# EAGLE design solenoid (EAGLE 8.2.1)
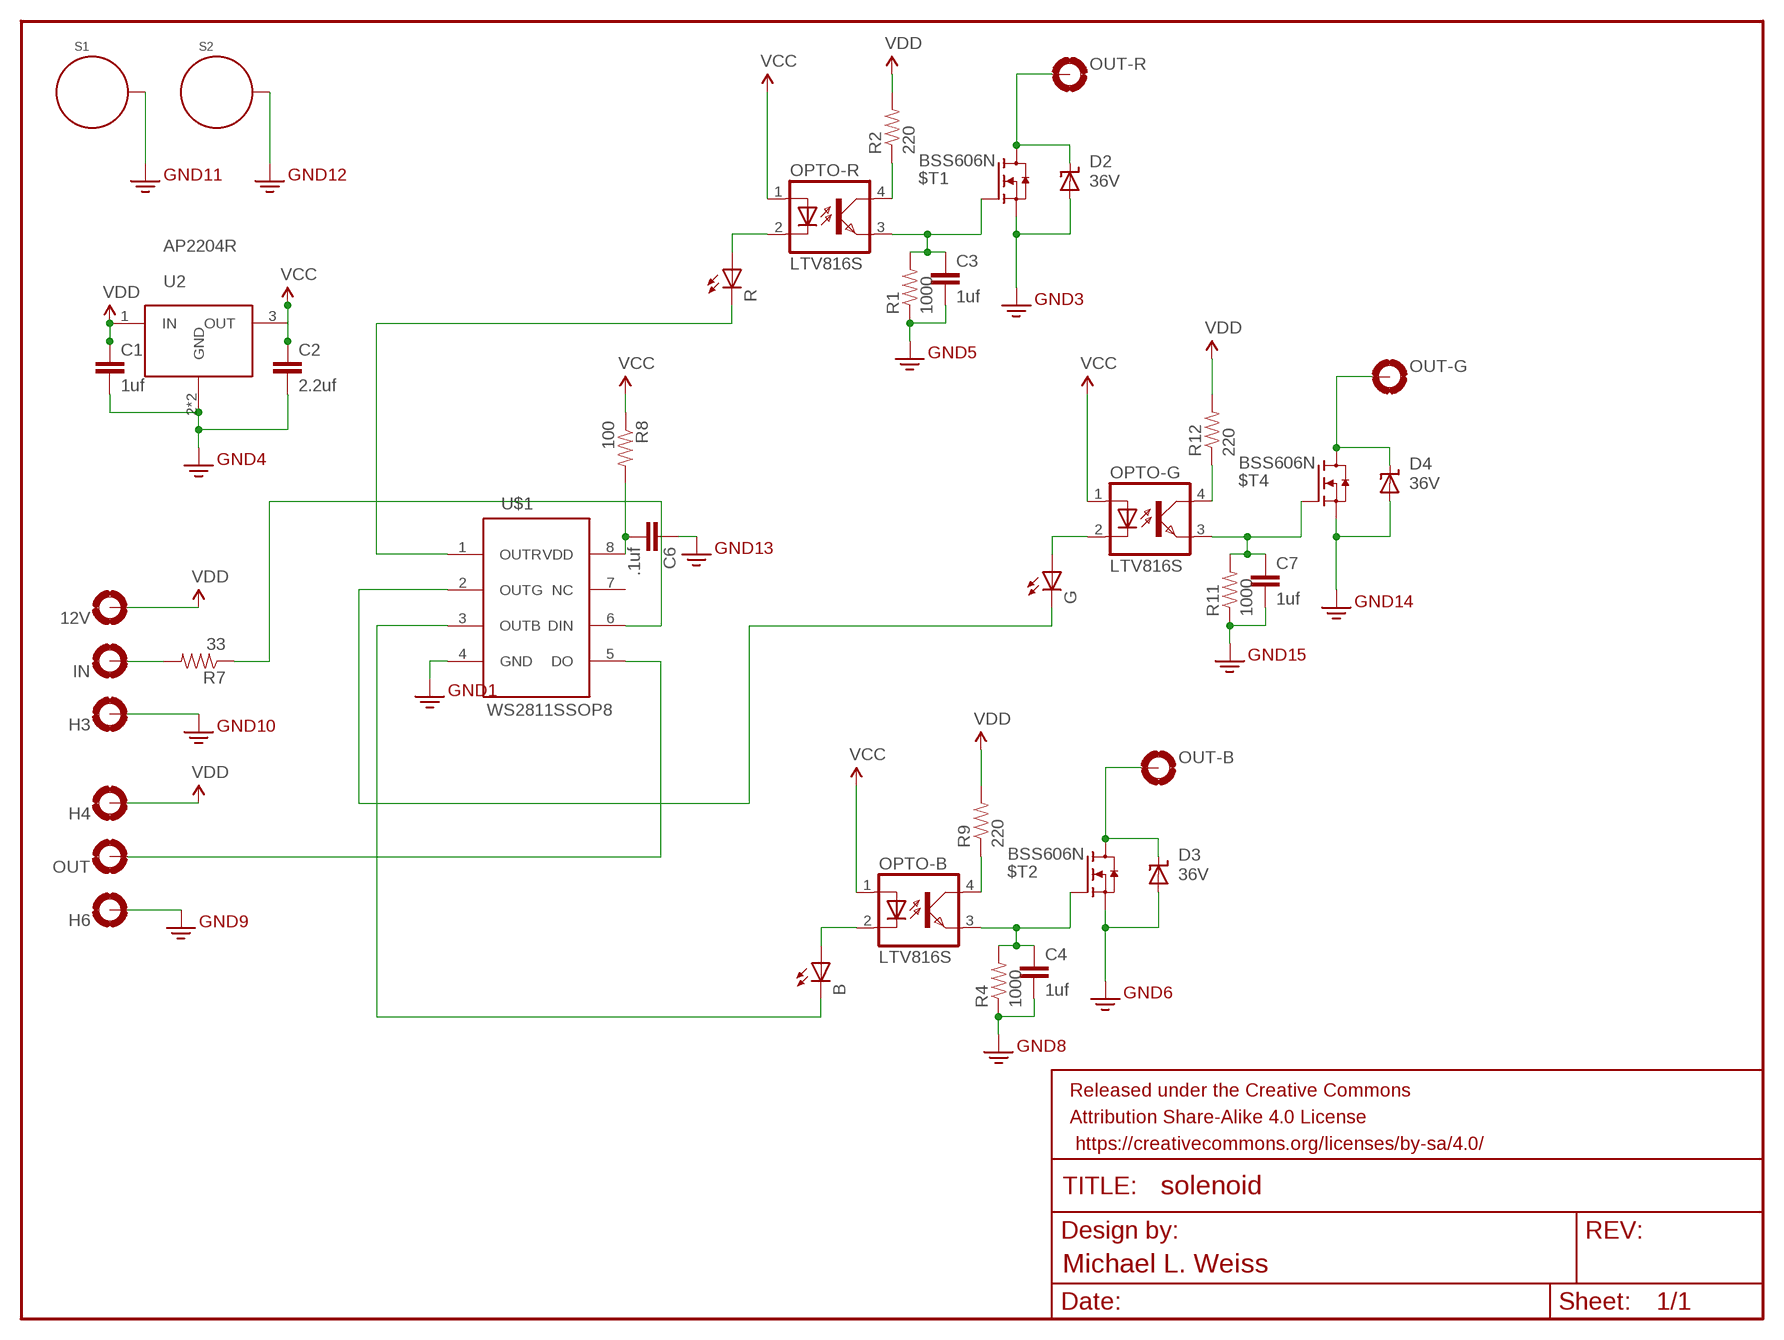
[diagram p0: schematic, sheet 1]

## Parts
12V  MOUNT-PAD-ROUND2.8  [2,8-PAD]
$T1  BSS606N  [SOT89R]
$T2  BSS606N  [SOT89R]
$T4  BSS606N  [SOT89R]
B  LEDCHIPLED_0805  [CHIPLED_0805]
C1  1uf  CAP0805  [0805]
C2  2.2uf  CAP0805  [0805]
C3  1uf  CAP0805  [0805]
C4  1uf  CAP0805  [0805]
C6  .1uf  CAP0805  [0805]
C7  1uf  CAP0805  [0805]
D2  36V  SUPPRESSOR-SMBJ  [SMBJ]
D3  36V  SUPPRESSOR-SMBJ  [SMBJ]
D4  36V  SUPPRESSOR-SMBJ  [SMBJ]
FRAME1  FRAME-LETTERNO_PACKAGE  [DUMMY]
G  LEDCHIPLED_0805  [CHIPLED_0805]
H3  MOUNT-PAD-ROUND2.8  [2,8-PAD]
H4  MOUNT-PAD-ROUND2.8  [2,8-PAD]
H6  MOUNT-PAD-ROUND2.8  [2,8-PAD]
IN  MOUNT-PAD-ROUND2.8  [2,8-PAD]
OPTO-B  LTV816S  [DIL4-SMD]
OPTO-G  LTV816S  [DIL4-SMD]
OPTO-R  LTV816S  [DIL4-SMD]
OUT  MOUNT-PAD-ROUND2.8  [2,8-PAD]
OUT-B  MOUNT-PAD-ROUND2.8  [2,8-PAD]
OUT-G  MOUNT-PAD-ROUND2.8  [2,8-PAD]
OUT-R  MOUNT-PAD-ROUND2.8  [2,8-PAD]
R  LEDCHIPLED_0805  [CHIPLED_0805]
R1  1000  RESISTOR0805-RES  [0805]
R2  220  RESISTOR0805-RES  [0805]
R4  1000  RESISTOR0805-RES  [0805]
R7  33  RESISTOR0805-RES  [0805]
R8  100  RESISTOR0805-RES  [0805]
R9  220  RESISTOR0805-RES  [0805]
R11  1000  RESISTOR0805-RES  [0805]
R12  220  RESISTOR0805-RES  [0805]
S1  STANDOFF_ELECTRICAL  [STANDOFF-ELECTRICAL]
S2  STANDOFF_ELECTRICAL  [STANDOFF-ELECTRICAL]
U2  AP2204R  [SOT89R]
U$1  WS2811SSOP8  [SOIC8_150MIL]

## Nets
GND: $T1.3(S) $T2.3(S) $T4.3(S) C1.2 C2.2 C3.2 C4.2 C6.1 C7.2 D2.A D3.A D4.A H3.B2,8(MOUNT) H6.B2,8(MOUNT) R1.1 R4.1 R11.1 S1.P1 S2.P1 U2.2(GND) U2.4(GND) U$1.4(GND) ; supply symbol labelled GND2
IN: IN.B2,8(MOUNT) R7.2
N$1: B.C U$1.3(OUTB)
N$5: G.C U$1.2(OUTG)
N$6: $T1.1(G) C3.1 OPTO-R.3(EMIT) R1.2
N$7: OPTO-R.4(COL) R2.1
N$8: OPTO-R.2(C) R.A
N$9: R.C U$1.1(OUTR)
N$12: $T2.1(G) C4.1 OPTO-B.3(EMIT) R4.2
N$13: R7.1 U$1.6(DIN)
N$15: OPTO-B.4(COL) R9.1
N$16: B.A OPTO-B.2(C)
N$19: $T4.1(G) C7.1 OPTO-G.3(EMIT) R11.2
N$20: OPTO-G.4(COL) R12.1
N$21: G.A OPTO-G.2(C)
N$31: C6.2 R8.2 U$1.8(VDD)
OUT: OUT.B2,8(MOUNT) U$1.5(DO)
OUT-B: $T2.2(D) $T2.4(D) D3.C OUT-B.B2,8(MOUNT)
OUT-G: $T4.2(D) $T4.4(D) D4.C OUT-G.B2,8(MOUNT)
OUT-R: $T1.2(D) $T1.4(D) D2.C OUT-R.B2,8(MOUNT)
VCC: C2.1 OPTO-B.1(A) OPTO-G.1(A) OPTO-R.1(A) R8.1 U2.3(OUT)
VDD: 12V.B2,8(MOUNT) C1.1 H4.B2,8(MOUNT) R2.2 R9.2 R12.2 U2.1(IN)
Unconnected: U$1.7(NC)

## Library data of the parts
12V H3 H4 H6 IN OUT OUT-B OUT-G OUT-R = holes:MOUNT-PAD-ROUND: MOUNTING PAD, round
$T1 $T2 $T4 = mishafarms:BSS606N
B G R = led:LED: LED OSRAM: - CHIPLED LG R971, LG N971, LY N971, LG Q971, LY Q971, LO R971, LY R971 LH N974, LH R974 LS Q976, LO Q976, LY Q976 LO Q996 - Hyper CHIPLED LW Q18S LB Q993, LB Q99A, LB R99A - SideLED LS A670, LO A670, LY A670, LG A670, LP A670 LB A673, LV A673, LT A673, LW A673 LH A674 LY A675 LS A676, LA A676, LO A676, LY A676, LW A676 LS A679, LY A679, LG A679 - Hyper Micro SIDELED® LS Y876, LA Y876, LO Y876, LY Y876 LT Y87S - SmartLED LW L88C, LW L88S LB L89C, LB L89S, LG L890 LS L89K, LO L89K, LY L89K LS L896, LA L896, LO L896, LY L896 - TOPLED LS T670, LO T670, LY T670, LG T670, LP T670 LSG T670, LSP T670, LSY T670, LOP T670, LYG T670 LG T671, LOG T671, LSG T671 LB T673, LV T673, LT T673, LW T673 LH T674 LS T676, LA T676, LO T676, LY T676, LB T676, LH T676, LSB T676, LW T676 LB T67C, LV T67C, LT T67C, LS T67K, LO T67K, LY T67K, LW E67C LS E67B, LA E67B, LO E67B, LY E67B, LB E67C, LV E67C, LT E67C LW T67C LS T679, LY T679, LG T679 LS T770, LO T770, LY T770, LG T770, LP T770 LB T773, LV T773, LT T773, LW T773 LH T774 LS E675, LA E675, LY E675, LS T675 LS T776, LA T776, LO T776, LY T776, LB T776 LHGB T686 LT T68C, LB T68C - Hyper Mini TOPLED® LB M676 - Mini TOPLED Santana® LG M470 LS M47K, LO M47K, LY M47K Source: http://www.osram.convergy.de LUXEON: - LUMILED® LXK2-PW12-R00, LXK2-PW12-S00, LXK2-PW14-U00, LXK2-PW14-V00 LXK2-PM12-R00, LXK2-PM12-S00, LXK2-PM14-U00 LXK2-PE12-Q00, LXK2-PE12-R00, LXK2-PE12-S00, LXK2-PE14-T00, LXK2-PE14-U00 LXK2-PB12-K00, LXK2-PB12-L00, LXK2-PB12-M00, LXK2-PB14-N00, LXK2-PB14-P00, LXK2-PB14-Q00 LXK2-PR12-L00, LXK2-PR12-M00, LXK2-PR14-Q00, LXK2-PR14-R00 LXK2-PD12-Q00, LXK2-PD12-R00, LXK2-PD12-S00 LXK2-PH12-R00, LXK2-PH12-S00 LXK2-PL12-P00, LXK2-PL12-Q00, LXK2-PL12-R00 Source: www.luxeon.com KINGBRIGHT: KA-3528ASYC Source: www.kingbright.com
C1-C4 C6 C7 = SparkFun-Capacitors:CAP: Capacitor Standard 0603 ceramic capacitor, and 0.1" leaded capacitor.
D2-D4 = mishafarms:SUPPRESSOR-: Suppressor diode
FRAME1 = SparkFun-Aesthetics:FRAME-LETTER: Schematic Frame Standard 8.5x11 US Letter frame; CREVISON: 1.1; DESIGNER: Michael L. Weiss; VERSION: v1.0
OPTO-B OPTO-G OPTO-R = optocoupler:LTV816: OPTO COUPLER Source: LITEON, LTV816.pdf
R1 R2 R4 R7-R9 R11 R12 = SparkFun-Passives:RESISTOR: Resistor Basic schematic elements and footprints for 0603, 1206, and PTH resistors.
S1 S2 = SparkFun-Electromechanical:STANDOFF_ELECTRICAL: A standoff intended to be an electrically connected point. Pad size and stop size allow for a #4 Phillips pan screw head to make a solid connection to the board.
U2 = mishafarms:AP2204R; VOLTAGE: 5.0
U$1 = mishafarms:WS2811S

## Board
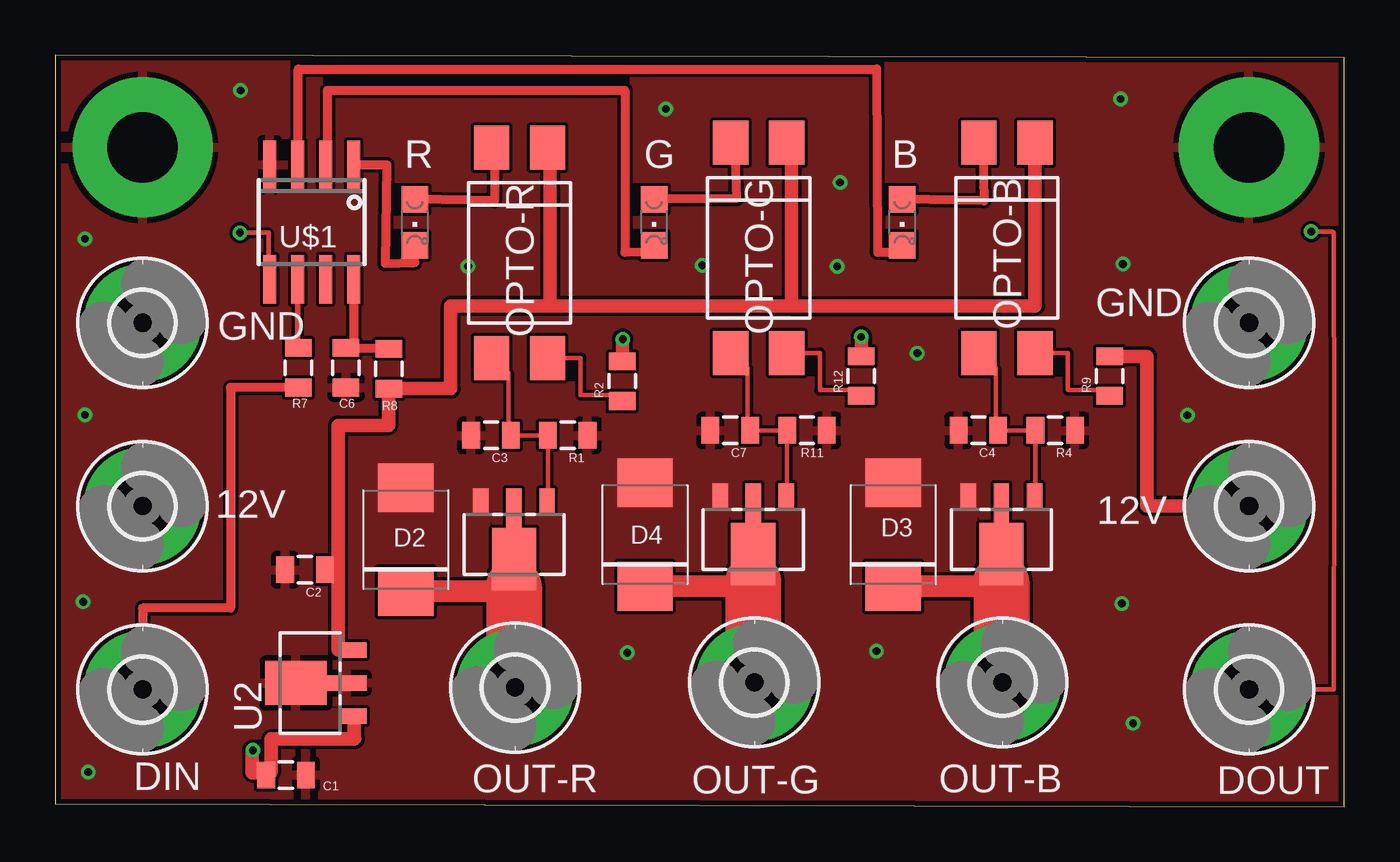
[diagram p1: board, top side]
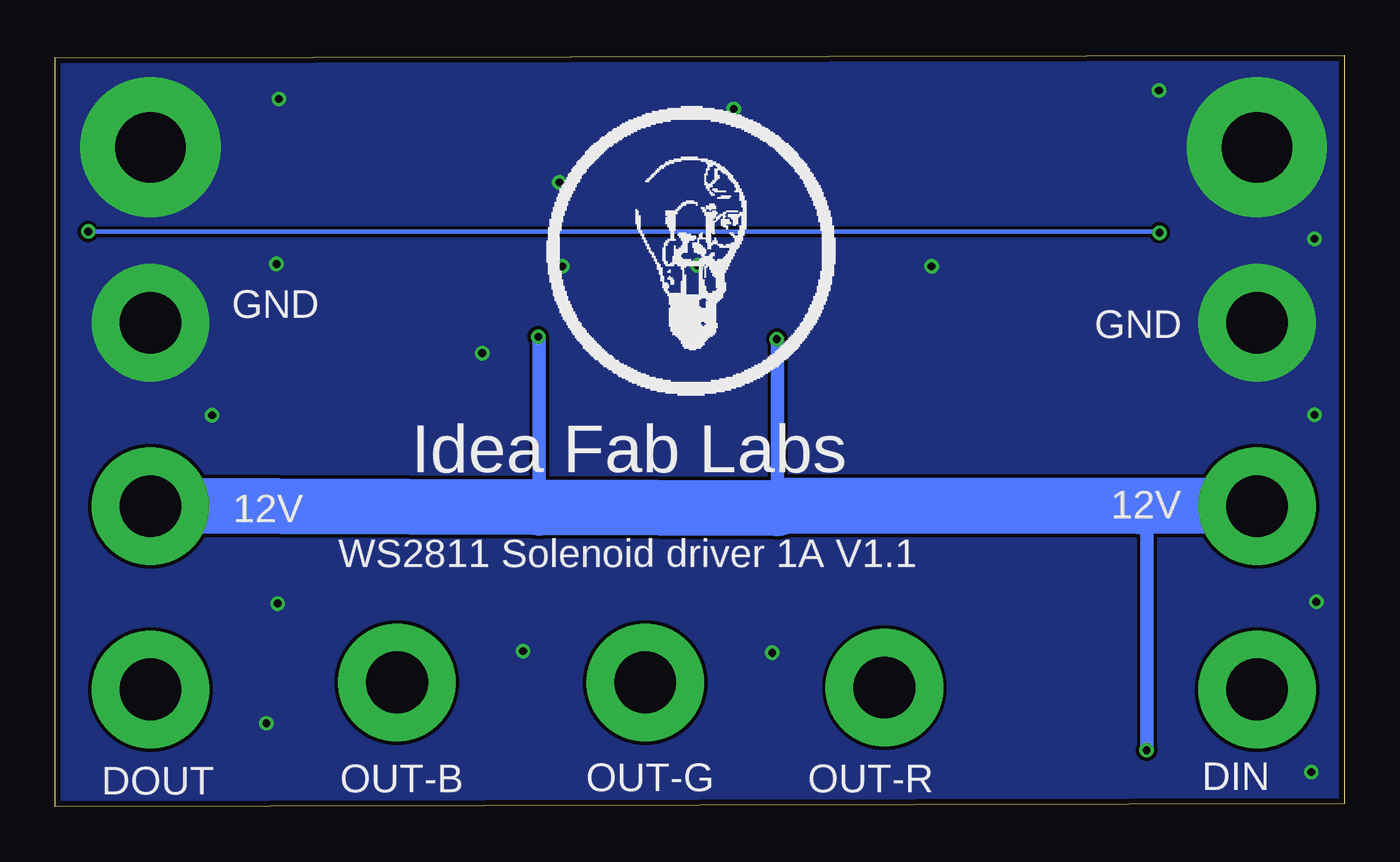
[diagram p2: board, bottom side, seen from below]

Size 58.45 x 34.09 mm. Coordinates in mm from the lower left corner, seen from the top.
Outline: 0,0.13 58.45,0 58.45,33.96 0,34.09 0,0.13
Copper layers (1*16): Top 0.035mm / dielectric 1.5mm / Bottom 0.035mm
Design rules "SeeedStudio_2layer_DRU_no_angle_20140221_mlw": minimum track width 6mil, minimum drill 12mil, track to track 6mil, track to pad 6mil, pad to pad 6mil, via to via 6mil, smd to smd 0mil, copper to edge 10mil, drill to drill 10mil, minimum pad ring 10mil, minimum via ring 6mil, stop-mask expansion 2mil, vias tented up to drill 100mil, thermal gap 10mil

### Footprints (pad centres in the part's own frame; a part is rotated, then mirrored left to right if it is on the bottom)
2,8-PAD = drill 2.8 pad 5.334: B2,8 0,0
SOT89R = smd 0.7 x 1.1: 1 -1.5,-1.75; 3 1.5,-1.75 | smd 0.7 x 1.8: 2 0,-1.4 | smd 2 x 2.8: 4 0,0.9
CHIPLED_0805 = smd 1.2 x 1.2: A 0,-1.05; C 0,1.05
0805 = smd 0.8 x 1.2: 1 -0.9,0; 2 0.9,0
SMBJ = smd 2.2 x 2.5: A 2.35,0; C -2.35,0
DIL4-SMD = smd 1.6 x 2: 1 -1.27,-4.77; 2 1.27,-4.77; 3 1.27,4.77; 4 -1.27,4.77
STANDOFF-ELECTRICAL = drill 3.2 pad 6.35: P1 0,0
SOIC8_150MIL = smd 0.6 x 2.2: 1 -1.905,-2.6; 2 -0.635,-2.6; 3 0.635,-2.6; 4 1.905,-2.6; 5 1.905,2.6; 6 0.635,2.6; 7 -0.635,2.6; 8 -1.905,2.6

### Placement (x,y rotation side)
12V  54.13,13.64 0 top
$T1  20.8,12.14 180 top
$T2  42.9,12.37 180 top
$T4  31.65,12.37 180 top
B  38.4,26.5 180 top
C1  10.46,1.45 0 top
C2  11.33,10.74 180 top
C3  19.76,16.84 180 top
C4  41.86,17.07 180 top
C6  13.18,19.91 90 top
C7  30.61,17.07 180 top
D2  15.9,12.12 90 top
D3  38,12.34 90 top
D4  26.75,12.34 90 top
FRAME1  -0.1,-0.91 0 top
G  27.15,26.5 180 top
H3  3.96,21.95 0 top
H4  3.96,13.64 0 top
H6  54.13,21.95 0 top
IN  3.96,5.32 0 top
OPTO-B  43.15,25.35 180 top
OPTO-G  31.9,25.35 180 top
OPTO-R  21.06,25.12 180 top
OUT  54.13,5.32 0 top
OUT-B  42.95,5.64 0 top
OUT-G  31.7,5.64 0 top
OUT-R  20.85,5.41 0 top
R  16.31,26.5 180 top
R1  23.24,16.84 180 top
R2  25.7,19.3 90 top
R4  45.34,17.07 180 top
R7  11.02,19.91 270 top
R8  15.14,19.86 90 top
R9  47.8,19.53 90 top
R11  34.09,17.07 180 top
R12  36.55,19.53 90 top
S1  3.96,29.91 0 top
S2  54.13,29.91 0 top
U2  11.81,5.61 90 top
U$1  11.63,26.52 180 top
U$2  IFL-LOGO  [IFL-LOGO]  29.54,23.11 0 top

### Tracks (layer width: path | path; a pad name or v marks a point on that pad's centre or on a via)
GND  (via drill 0.35)
  other vias: 48.31,32.11 48.36,9.22 37.24,7.06 25.93,6.98 27.69,31.65 39.09,20.57 35.59,28.32 35.46,24.51 29.34,24.56 18.72,24.51 48.41,24.61 8.41,32.49 1.5,1.57 1.27,9.3 1.35,17.78 1.35,25.76 51.33,17.75 48.87,3.78
  pour Top (rank 4): 0,0.13 -0.03,34.19 58.37,33.93 58.39,-0.13
  pour Bottom (rank 2, no thermals): 0,0.13 -0.08,34.09 58.32,33.81 58.39,-0.15
  pour Top (no thermals): 20.09,15.7 20.02,13.03 14.3,13.03 14.3,15.7
  pour Top (no thermals): 30.94,15.93 30.86,13.26 25.15,13.26 25.15,15.93
  pour Top (no thermals): 42.19,15.93 42.11,13.26 36.4,13.26 36.4,15.93
IN
  Top 0.406: R7.2 7.95,19.01 7.95,9.02 3.96,9.02 IN.B2,8
N$1
  Top 0.203: U$1.3 11.02,29.12
  Top 0.406: 11.02,29.12 11.02,33.45 37.24,33.45 37.29,25.15 38.41,25.15 B.C
N$5
  Top 0.406: U$1.2 12.34,29.12 12.34,32.49 25.83,32.49 25.83,25.15 27.15,25.17 G.C
N$6
  Top 0.203: $T1.1 22.34,13.93 R1.2 C3.1 20.55,16.95 20.55,19.66 19.86,20.35 OPTO-R.3
N$7
  Top 0.203: OPTO-R.4 23.82,20.35 23.82,18.67 25.7,18.67 R2.1
N$8
  Top 0.406: OPTO-R.2 19.94,30.48 19.91,27.48 R.A
N$9
  Top 0.406: U$1.1 15.04,29.12 14.96,24.64 16.31,24.69 R.C
N$12
  Top 0.203: $T2.1 44.44,14.16 R4.2 C4.1 42.65,17.18 42.65,19.89 41.96,20.58 OPTO-B.3
N$13
  Top 0.254: R7.1 11,20.81 U$1.6
N$15
  Top 0.203: OPTO-B.4 45.92,20.58 45.92,18.9 47.8,18.9 R9.1
N$16
  Top 0.406: OPTO-B.2 42.04,30.71 42.11,27.48 B.A
N$19
  Top 0.203: $T4.1 33.19,14.16 R11.2 C7.1 31.39,17.18 31.39,19.89 30.7,20.58 OPTO-G.3
N$20
  Top 0.203: OPTO-G.4 34.67,20.58 34.67,18.9 36.55,18.9 R12.1
N$21
  Top 0.406: OPTO-G.2 30.79,30.71 30.89,27.58 G.A
N$31
  Top 0.406: 13.64,20.81 C6.2 | 13.64,20.81 15.09,20.81 R8.2 | U$1.8 13.54,20.91 13.64,20.81
OUT  (via drill 0.35)
  Top 0.203: OUT.B2,8 57.96,5.32 57.99,16.51 57.96,26.04 57.89,26.09 v56.95,26.09 | v8.38,26.04 9.68,26.04 9.68,24.64 9.73,24.64 U$1.5
  Bottom 0.203: v56.95,26.09 8.38,26.09 v8.38,26.04
OUT-B
  Top 0.203: $T2.2 $T2.4
  Top 1.016: $T2.4 42.9,10.21 42.87,10.01 D3.C | 42.9,5.69 OUT-B.B2,8
  Top 2.54: 42.9,10.21 42.9,5.69
OUT-G
  Top 0.203: $T4.2 $T4.4
  Top 1.016: $T4.4 31.65,10.21 31.62,10.01 D4.C | 31.65,5.69 OUT-G.B2,8
  Top 2.54: 31.65,10.21 31.65,5.69
OUT-R
  Top 0.203: $T1.2 $T1.4
  Top 1.016: $T1.4 20.8,9.98 20.77,9.78 D2.C | 20.8,5.46 OUT-R.B2,8
  Top 2.54: 20.8,9.98 20.8,5.46
VCC
  Top 0.61: 22.43,22.71 17.93,22.71 17.93,18.96 R8.1 15.11,18.94 15.11,17.3 12.83,17.3 12.83,10.85 | 33.38,22.71 22.43,22.71 | 33.38,22.71 44.42,22.71 OPTO-B.1 | OPTO-R.1 22.43,29.89 22.43,22.71 | OPTO-G.1 33.38,30.12 33.38,22.71 | U2.3 12.83,7.11 12.83,10.85 | 12.83,10.85 12.23,10.85 C2.1
VDD  (via drill 0.35)
  Top 0.406: v8.97,2.57 arc90 8.94,2.54 | 9.46,1.55 arc-90 C1.1 | 13.59,3.07 arc90 13.64,3.12 arc-90 13.56,3.2
  Top 0.61: 12V.B2,8 49.51,13.64 49.51,20.42 47.8,20.42 R9.2 | R2.2 25.73,20.2 v25.73,21.21 | R12.2 v36.55,21.31 | 8.94,2.54 8.94,1.55 9.46,1.55 | C1.1 arc90 9.8,1.69 9.8,3.07 13.59,3.07 | 13.56,3.2 U2.1
  Bottom 0.406: 9.3,13.64 arc90 8.97,13.31
  Bottom 0.61: v25.73,21.21 25.7,21.11 25.7,13.53 | v36.55,21.31 36.5,21.26 36.5,13.57 | 8.97,13.31 v8.97,2.57
  Bottom 2.54: 12V.B2,8 36.5,13.57 25.7,13.53 arc45 25.46,13.64 9.3,13.64 H4.B2,8

### Text on the board
tPlace: GND | GND | 12V | 12V | DIN | OUT-R | OUT-B | OUT-G | DOUT
bPlace: GND | GND | 12V | 12V | WS2811 Solenoid driver 1A V1.1 | DIN | OUT-R | OUT-G | OUT-B | DOUT
tDocu: + | + | +